# Altium schematic sheet Power.SchDoc
size A
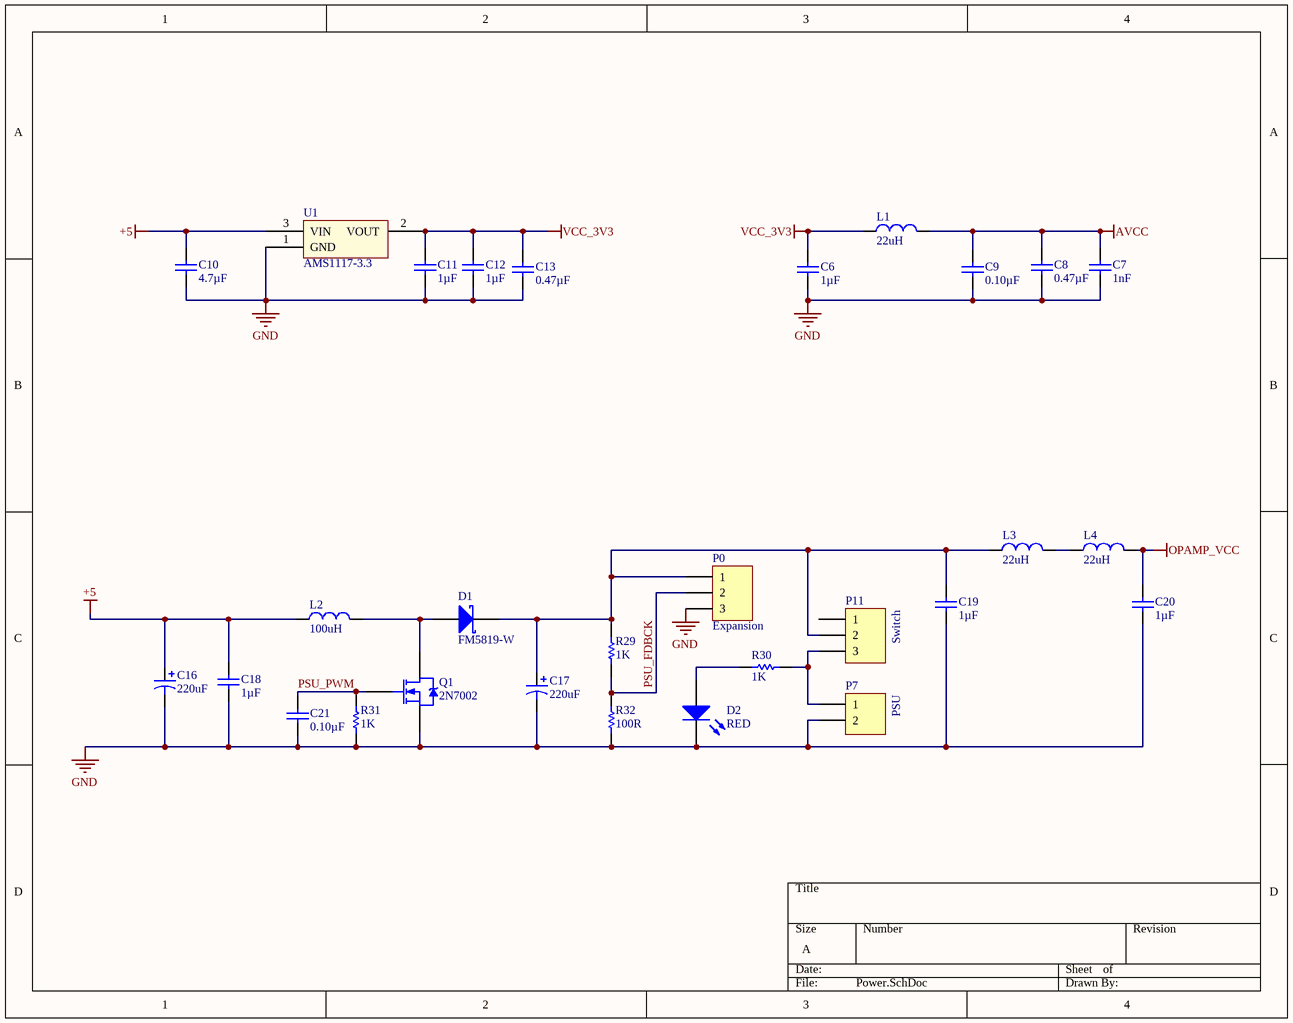
[diagram p0: Power.SchDoc]

## Parts
C6  1µF  [CAPC200X125X75L45N]
C7  1nF  [CAPC200X125X75L45N]
C8  0.47µF  [CAPC200X125X75L45N]
C9  0.10µF  [CAPC200X125X75L45N]
C10  4.7µF  [CAPC200X125X75L45N]
C11  1µF  [CAPC200X125X75L45N]
C12  1µF  [CAPC200X125X75L45N]
C13  0.47µF  [CAPC200X125X75L45N]
C16  value 220uF  [Cap_Elec_47uF]  (hidden comment: CAP_POLAR)
C17  value 220uF  [Cap_Elec_47uF]  (hidden comment: CAP_POLAR)
C18  1µF  [CAPC200X125X75L45N]
C19  1µF  [CAPC200X125X75L45N]
C20  1µF  [CAPC200X125X75L45N]
C21  0.10µF  [CAPC200X125X75L45N]
D1  FM5819-W  [DIOM470X266X220L114X139N]
D2  RED  [LEDC200X125X38L45N]
L1  22uH  [CAPC200X125X140L45N]
L2  100uH  [CD54-Modified]
L3  22uH  [CAPC200X125X140L45N]
L4  22uH  [CAPC200X125X140L45N]
P0  Expansion  [HDR1X3]
P7  PSU  [HDR1X2]
P11  Switch  [HDR1X3]
Q1  2N7002  [SOT23-3P95_230X110L30X43N]
R29  1K  [RESC200X125X50L35N]
R30  1K  [RESC200X125X50L35N]
R31  1K  [RESC200X125X50L35N]
R32  100R  [RESC200X125X50L35N]
U1  AMS1117-3.3  [SOT223-4P229_700X180L36X74N]

## Nets
+5: C10.2 C16.2 C18.2 L2.1 U1.3(VIN)
AVCC: C7.2 C8.2 C9.2 L1.2
GND: C6.1 C7.1 C8.1 C9.1 C10.1 C11.1 C12.1 C13.1 C16.1 C17.1 C18.1 C19.1 C20.1 C21.1 D2.C(K) P0.3 P7.2 Q1.2(S) R31.1 R32.1 U1.1(GND)
OPAMP_VCC: C20.2 L4.2
VCC_3V3: C6.2 C11.2 C12.2 C13.2 L1.1 U1.2(VOUT)
PSU_FDBCK: P0.2 R29.1 R32.2
PSU_PWM: C21.2 Q1.1(G) R31.2
NetC17_2: C17.2 C19.2 D1.C L3.1 P0.1 P11.2 R29.2
NetD1_A: D1.A L2.2 Q1.3(D)
NetD2_A: D2.A R30.1
NetL3_2: L3.2 L4.1
NetP7_1: P7.1 P11.3 R30.2

Not connected (* = marked no-connect by the designer): P11 1

## Library data of the parts
C6 C11 C12 C18-C20 = 885012107015: 1µF 25V Ceramic Capacitor X5R 0805 (2012 Metric) 0.079" L x 0.049" W (2.00mm x 1.25mm); Manufacturer: Wurth Electronics; Capacitance: 1uF; Tolerance: 20%; Supplier 1: Farnell; Manufacturer Part Number: 885012107015; Stock 1: 0; Mount: Surface Mount; Case/Package: 0805; Case Code (Metric): 2012; Case Code (Imperial): 0805; Min Operating Temperature: -55°C; Max Operating Temperature: 85°C; Packaging: Tape and Reel; Voltage Rating: 25V; Length: 0.079inch; Width: 0.049inch; Thickness: 0.053inch
C7 = 885012207033: 1000pF 16V Ceramic Capacitor X7R 0805 (2012 Metric) 0.079" L x 0.049" W (2.00mm x 1.25mm); Manufacturer: Wurth Electronics; Tolerance: 10%; Supplier 1: Newark; Manufacturer Part Number: 885012207033; Stock 1: 3260; Pricing 1: 10=0.035, 25=0.034, 50=0.032, 100=0.031, 250=0.03, 500=0.028 (USD); Mount: Surface Mount; Case/Package: 0805; Case Code (Metric): 2012; Case Code (Imperial): 0805; Min Operating Temperature: -55°C; Max Operating Temperature: 125°C; Packaging: Tape and Reel; Capacitance: 1nF; Voltage Rating: 16V; Length: 0.079inch; Width: 0.049inch; Thickness: 0.035inch
C8 C13 = 885012207020: 0.47µF 10V Ceramic Capacitor X7R 0805 (2012 Metric) 0.079" L x 0.049" W (2.00mm x 1.25mm); Manufacturer: Wurth Electronics; Capacitance: 470nF; Tolerance: 10%; Supplier 1: Newark; Manufacturer Part Number: 885012207020; Stock 1: 2295; Pricing 1: 5=0.11, 10=0.098, 25=0.095, 50=0.091, 100=0.088, 250=0.083, 500=0.078 (USD); Mount: Surface Mount; Case/Package: 0805; Case Code (Metric): 2012; Case Code (Imperial): 0805; Min Operating Temperature: -55°C; Max Operating Temperature: 125°C; Packaging: Tape and Reel; Voltage Rating: 10V; Length: 0.079inch; Width: 0.049inch; Thickness: 0.053inch
C9 C21 = 885012207016: 0.10µF 10V Ceramic Capacitor X7R 0805 (2012 Metric) 0.079" L x 0.049" W (2.00mm x 1.25mm); Manufacturer: Wurth Electronics; Capacitance: 100nF; Tolerance: 10%; Supplier 1: Mouser; Manufacturer Part Number: 885012207016; Stock 1: 13980; Pricing 1: 1=0.1, 10=0.045, 50=0.045, 100=0.04, 1000=0.035, 10000=0.035 (USD); Mount: Surface Mount; Case/Package: 0805; Case Code (Metric): 2012; Case Code (Imperial): 0805; Min Operating Temperature: -55°C; Max Operating Temperature: 125°C; Packaging: Cut Tape; Voltage Rating: 10V; Length: 0.079inch; Width: 0.049inch; Thickness: 0.035inch
C10 = 885012107013: 4.7µF 16V Ceramic Capacitor X5R 0805 (2012 Metric) 0.079" L x 0.049" W (2.00mm x 1.25mm); Manufacturer: Wurth Electronics; Capacitance: 4.7uF; Tolerance: 20%; Supplier 1: Farnell; Manufacturer Part Number: 885012107013; Stock 1: 0; Mount: Surface Mount; Case/Package: 0805; Case Code (Metric): 2012; Case Code (Imperial): 0805; Min Operating Temperature: -55°C; Max Operating Temperature: 85°C; Packaging: Tape and Reel; Voltage Rating: 16V; Length: 0.079inch; Width: 0.049inch; Thickness: 0.057inch
C16 C17 = CAP_POLAR: Aluminium Electrolyte 16V max
D1 = FM5819-W: Schottky Diodes & Rectifiers Vr/40V Io/1A T/R; Manufacturer: Rectron; Max Surge Current: 25A; Element Configuration: Single; Max Reverse Leakage Current: 200uA; Supplier 1: Mouser; Manufacturer Part Number: FM5819-W; Stock 1: 20026; Pricing 1: 1=0.15, 10=0.15, 50=0.13, 100=0.1, 1000=0.072, 10000=0.042 (USD); Min Operating Temperature: -55°C; Max Operating Temperature: 150°C; Package Quantity: 5000; Packaging: Tape and Reel
D2 = LH R974-LP-1: LED RED DIFFUSED 0805 SMD; Manufacturer: OSRAM Opto Semiconductors Inc.; Lens Color: White; Millicandela Rating: 41mcd; Lens Style/Size: Rectangle with Flat Top, 1.30mm x 1.25mm; Voltage - Forward (Vf) (Typ): 1.8V; Current - Test: 20mA; Viewing Angle: 160°; Wavelength - Dominant: 645nm; Wavelength - Peak: 660nm; Supplier 1: Digi-Key; Manufacturer Part Number: LH R974-LP-1; RoHS: RoHS Compliant; Category: Optoelectronics; Stock 1: 128309; Pricing 1: 1=0.25, 10=0.18, 25=0.1328, 100=0.0948, 250=0.06448, 500=0.0569, 1000=0.04457 (USD); Packaging: Cut Tape (CT); Part Status: Active; Color: Red; Lens Transparency: Diffused; Mounting Type: Surface Mount; Features: -; Package / Case: 0805 (2012 Metric); Size / Dimension: 2.00mm L x 1.25mm W; Height (Max): 0.90mm; ComponentLink1URL: http://www.osram-os.com/Graphics/XPic8/00078869_0.pdf; ComponentLink1Description: http://www.osram-os.com/Graphics/XPic8/00078869_0.pdf
L1 L3 L4 = LBC2016T220M: Fixed Inductor 22uH 20% 165mA; Supplier 1: Arrow
L2 = CD75NP-331KC: FIXED IND 100uH 400MA 1.26 OHM; Manufacturer: Sumida America Components Inc.; Material - Core: Ferrite; Inductance: 330µH; Tolerance: ±10%; Shielding: Unshielded; DC Resistance (DCR): 1.26 Ohm Max; Supplier 1: Digi-Key; Manufacturer Part Number: CD75NP-331KC; RoHS: RoHS Compliant; Category: Inductors, Coils, Chokes; Stock 1: 0; Pricing 1: 500=0.504 (USD); Packaging: Tape & Reel (TR); Part Status: Active; Type: -; Current Rating: 400mA; Current - Saturation: -; Q @ Freq: -; Frequency - Self Resonant: -; Ratings: -; Operating Temperature: -40°C ~ 100°C; Mounting Type: Surface Mount; Package / Case: Nonstandard; Supplier Device Package: -; Size / Dimension: 0.307" L x 0.276" W (7.80mm x 7.00mm); Height - Seated (Max): 0.217" (5.50mm); ComponentLink1URL: http://products.sumida.com/products/pdf/CD75.pdf; ComponentLink1Description: http://products.sumida.com/products/pdf/CD75.pdf
P0 P11 = Header 3: Header, 3-Pin; LatestRevisionDate: 17-Jul-2002; LatestRevisionNote: Re-released for DXP Platform.; Publisher: Altium Limited
P7 = Header 2: Header, 2-Pin; LatestRevisionDate: 17-Jul-2002; LatestRevisionNote: Re-released for DXP Platform.; Publisher: Altium Limited
Q1 = 2N7002LT1G: MOSFET N-CH 60V 0.115A SOT-23; Manufacturer: ON Semiconductor; FET Type: N-Channel; Current - Continuous Drain (Id) @ 25°C: 115mA (Tc); Drive Voltage (Max Rds On,  Min Rds On): 5V, 10V; Vgs(th) (Max) @ Id: 2.5V @ 250µA; Input Capacitance (Ciss) (Max) @ Vds: 50pF @ 25V; Vgs (Max): ±20V; Power Dissipation (Max): 225mW (Ta); Rds On (Max) @ Id, Vgs: 7.5 Ohm @ 500mA, 10V; Supplier 1: Digi-Key; Manufacturer Part Number: 2N7002LT1G; RoHS: RoHS Compliant; Category: Discrete Semiconductor Products; Stock 1: 446807; Pricing 1: 1=0.14, 10=0.129, 100=0.0704, 500=0.0433, 1000=0.02952 (USD); Packaging: Cut Tape (CT); Part Status: Active; Technology: MOSFET (Metal Oxide); Drain to Source Voltage (Vdss): 60V; Gate Charge (Qg) (Max) @ Vgs: -; FET Feature: -; Operating Temperature: -55°C ~ 150°C (TJ); Mounting Type: Surface Mount; Supplier Device Package: SOT-23-3 (TO-236); Package / Case: TO-236-3, SC-59, SOT-23-3; ComponentLink1URL: http://www.onsemi.com/pub_link/Collateral/2N7002L-D.PDF; ComponentLink1Description: http://www.onsemi.com/pub_link/Collateral/2N7002L-D.PDF
R29-R31 = RC0805FR-071KL: RES SMD 1K OHM 1% 1/8W 0805; Manufacturer: Yageo; Power (Watts): 0.125W, 1/8W; Temperature Coefficient: ±100ppm/°C; Supplier 1: Digi-Key; Manufacturer Part Number: RC0805FR-071KL; RoHS: RoHS Compliant; Category: Resistors; Stock 1: 6960895; Pricing 1: 1=0.1, 10=0.019, 25=0.0136, 50=0.0104, 100=0.0077, 250=0.00584, 500=0.00468, 1000=0.00345 (USD); Packaging: Cut Tape (CT); Part Status: Active; Resistance (Ohms): 1k; Tolerance: ±1%; Composition: Thick Film; Features: Moisture Resistant; Operating Temperature: -55°C ~ 155°C; Package / Case: 0805 (2012 Metric); Supplier Device Package: 0805; Size / Dimension: 0.079" L x 0.049" W (2.00mm x 1.25mm); Height - Seated (Max): 0.024" (0.60mm); Number of Terminations: 2; Failure Rate: -; ComponentLink1URL: http://www.yageo.com/NewPortal/yageodocoutput?fileName=/pdf/R-Chip/PYu-RC_Group_51_RoHS_L_4.pdf; ComponentLink1Description: http://www.yageo.com/NewPortal/yageodocoutput?fileName=/pdf/R-Chip/PYu-RC_Group_51_RoHS_L_4.pdf
R32 = RC0805JR-07100RL: YAGEO         RC0805JR-07100RL             RES, THICK FILM, 100R, 5%, 0.125W, 0805; Temperature Coefficient: 100ppm/°C; Power Rating: 125mW; Voltage Rating: 150V; Supplier 1: Future Electronics; Manufacturer: Yageo; Manufacturer Part Number: RC0805JR-07100RL; Stock 1: 0; Case/Package: 0805; Contact Plating: Lead,Matte,Tin; Case Code (Imperial): 0805; Case Code (Metric): 2012; Min Operating Temperature: -55°C; Max Operating Temperature: 155°C; Tolerance: 5%; Resistance: 100R; Composition: Thick Film; Packaging: Tape and Reel; Termination: SMD/SMT; Radiation Hardening: No; REACH SVHC: Unknown; Lead Free: Lead Free; ComponentLink1URL: http://www.farnell.com/datasheets/444164.pdf; ComponentLink1Description: http://www.farnell.com/datasheets/444164.pdf; ComponentLink2URL: http://www.farnell.com/datasheets/2167052.pdf; ComponentLink2Description: http://www.farnell.com/datasheets/2167052.pdf; ComponentLink3URL: http://www.farnell.com/datasheets/442941.pdf; ComponentLink3Description: http://www.farnell.com/datasheets/442941.pdf; ComponentLink4URL: http://www.yageo.ru/pdf/RC0805.pdf; ComponentLink4Description: http://www.yageo.ru/pdf/RC0805.pdf
U1 = AMS1117-3.3: Linear Reg 3.3, 1.2V dropout